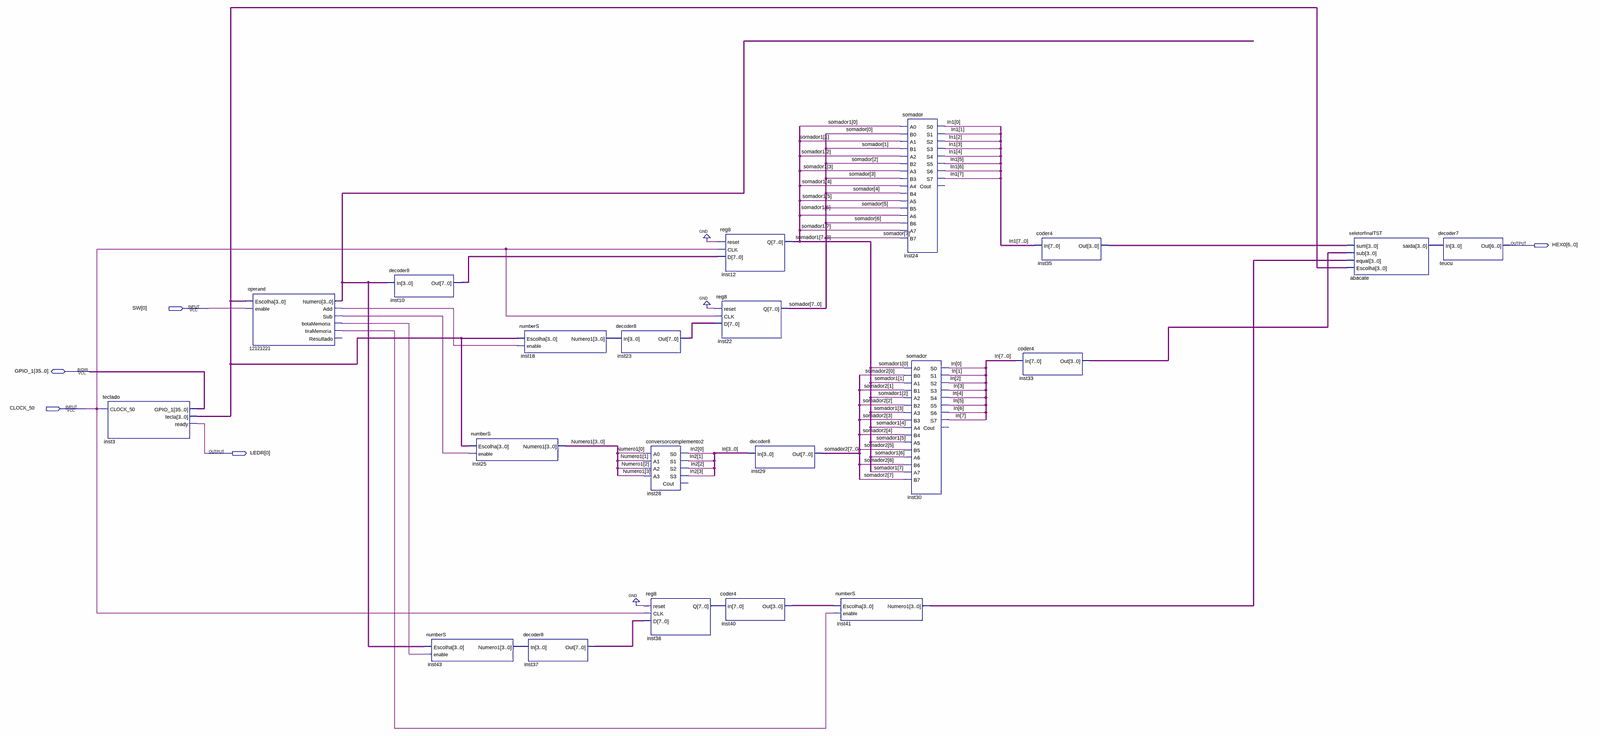
[diagram p0: schematic sheet, whole]
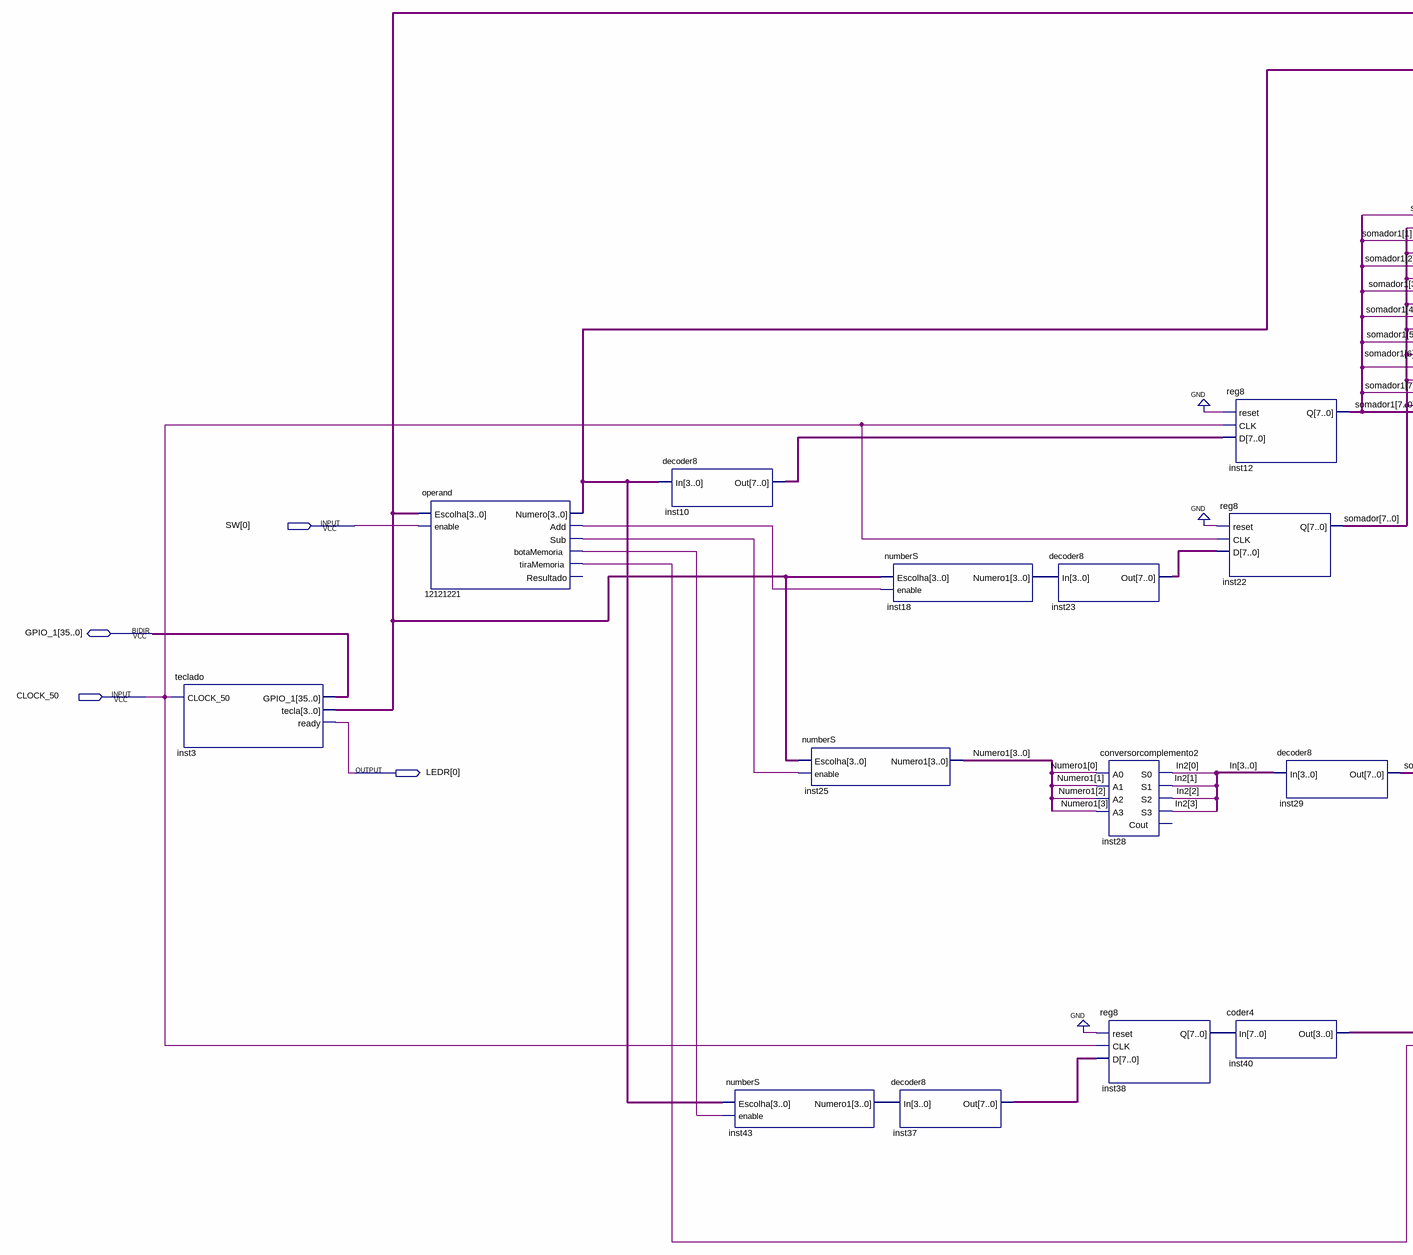
[diagram p1: schematic sheet, left part]
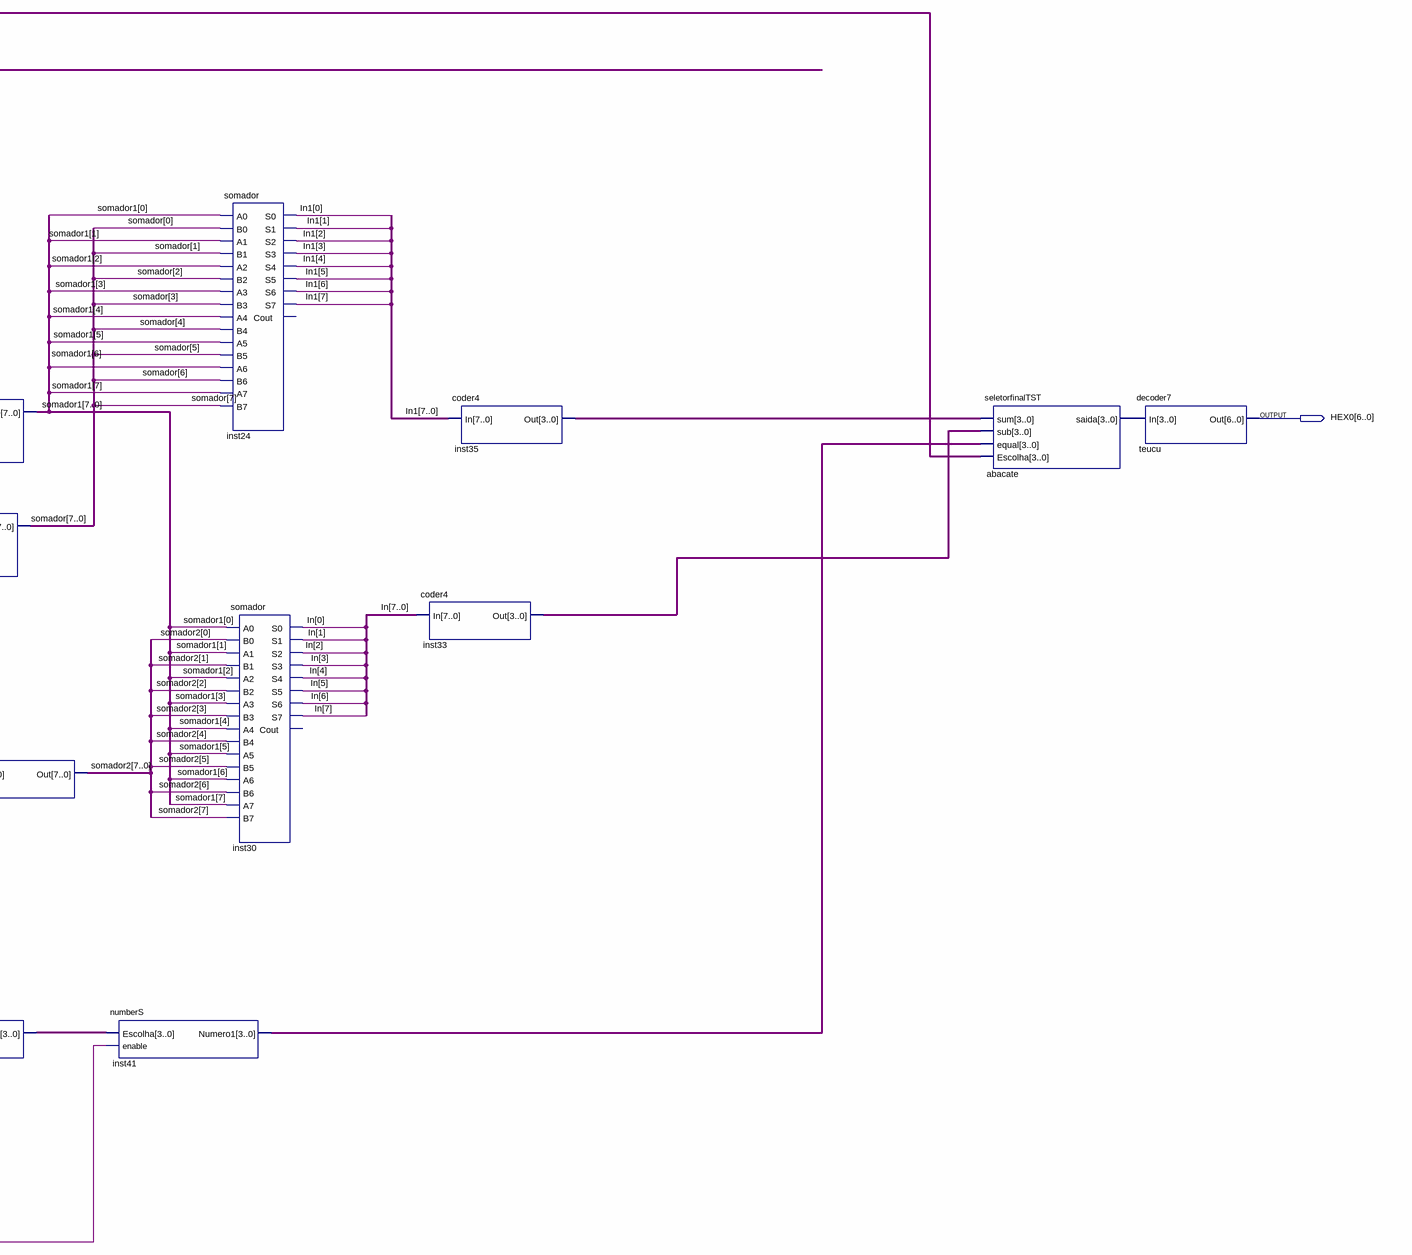
[diagram p2: schematic sheet, right part]
// Quartus schematic top.bdf as structural Verilog: 21 symbols, 5 pins
module top (
  input  [0:0] SW,
  input  CLOCK_50,
  inout  [35:0] GPIO_1,
  output [6:0] HEX0,
  output [0:0] LEDR
);

  wire n12121221_add, n12121221_botamemoria, n12121221_sub, n12121221_tiramemoria;
  wire [3:0] abacate_saida, In2, inst3_tecla, inst18_numero1, inst33_out, inst35_out, inst40_out,
       inst41_numero1, inst43_numero1, n12121221_numero, Numero1;
  wire [7:0] In, In1, inst10_out, inst23_out, inst37_out, inst38_q, somador, somador1, somador2;

  teclado inst3 (.CLOCK_50(CLOCK_50), .tecla(inst3_tecla), .ready(LEDR[0]), .GPIO_1(GPIO_1));
  operand u_12121221 (
    .Escolha(inst3_tecla), .enable(SW[0]), .Numero(n12121221_numero), .Add(n12121221_add),
    .Sub(n12121221_sub), .botaMemoria(n12121221_botamemoria), .tiraMemoria(n12121221_tiramemoria));  // open: Resultado
  decoder8 inst10 (.In(n12121221_numero), .Out(inst10_out));
  numberS inst43 (.Escolha(n12121221_numero), .enable(n12121221_botamemoria), .Numero1(inst43_numero1));
  numberS inst25 (.Escolha(inst3_tecla), .enable(n12121221_sub), .Numero1(Numero1));
  numberS inst18 (.Escolha(inst3_tecla), .enable(n12121221_add), .Numero1(inst18_numero1));
  decoder8 inst37 (.In(inst43_numero1), .Out(inst37_out));
  decoder8 inst23 (.In(inst18_numero1), .Out(inst23_out));
  conversorcomplemento2 inst28 (
    .A0(Numero1[0]), .A1(Numero1[1]), .A2(Numero1[2]), .A3(Numero1[3]), .S0(In2[0]), .S1(In2[1]),
    .S2(In2[2]), .S3(In2[3]));  // open: Cout
  reg8 inst38 (.reset(1'b0), .CLK(CLOCK_50), .D(inst37_out), .Q(inst38_q));
  reg8 inst12 (.reset(1'b0), .CLK(CLOCK_50), .D(inst10_out), .Q(somador1));
  reg8 inst22 (.reset(1'b0), .CLK(CLOCK_50), .D(inst23_out), .Q(somador));
  coder4 inst40 (.In(inst38_q), .Out(inst40_out));
  decoder8 inst29 (.In(In[3:0]), .Out(somador2));
  numberS inst41 (.Escolha(inst40_out), .enable(n12121221_tiramemoria), .Numero1(inst41_numero1));
  somador inst24 (
    .A0(somador1[0]), .B0(somador[0]), .A1(somador1[1]), .B1(somador[1]), .A2(somador1[2]), .B2(somador[2]),
    .A3(somador1[3]), .B3(somador[3]), .A4(somador1[4]), .B4(somador[4]), .A5(somador1[5]), .B5(somador[5]),
    .A6(somador1[6]), .B6(somador[6]), .A7(somador1[7]), .B7(somador[7]), .S0(In1[0]), .S1(In1[1]),
    .S2(In1[2]), .S3(In1[3]), .S4(In1[4]), .S5(In1[5]), .S6(In1[6]), .S7(In1[7]));  // open: Cout
  somador inst30 (
    .A0(somador1[0]), .B0(somador2[0]), .A1(somador1[1]), .B1(somador2[1]), .A2(somador1[2]),
    .B2(somador2[2]), .A3(somador1[3]), .B3(somador2[3]), .A4(somador1[4]), .B4(somador2[4]),
    .A5(somador1[5]), .B5(somador2[5]), .A6(somador1[6]), .B6(somador2[6]), .A7(somador1[7]),
    .B7(somador2[7]), .S0(In[0]), .S1(In[1]), .S2(In[2]), .S3(In[3]), .S4(In[4]), .S5(In[5]), .S6(In[6]),
    .S7(In[7]));  // open: Cout
  coder4 inst33 (.In(In), .Out(inst33_out));
  coder4 inst35 (.In(In1), .Out(inst35_out));
  seletorfinalTST abacate (
    .sum(inst35_out), .sub(inst33_out), .equal(inst41_numero1), .Escolha(inst3_tecla), .saida(abacate_saida));
  decoder7 teucu (.In(abacate_saida), .Out(HEX0));
endmodule
